# EAGLE design roboboard20M2 (EAGLE 7.1.0)
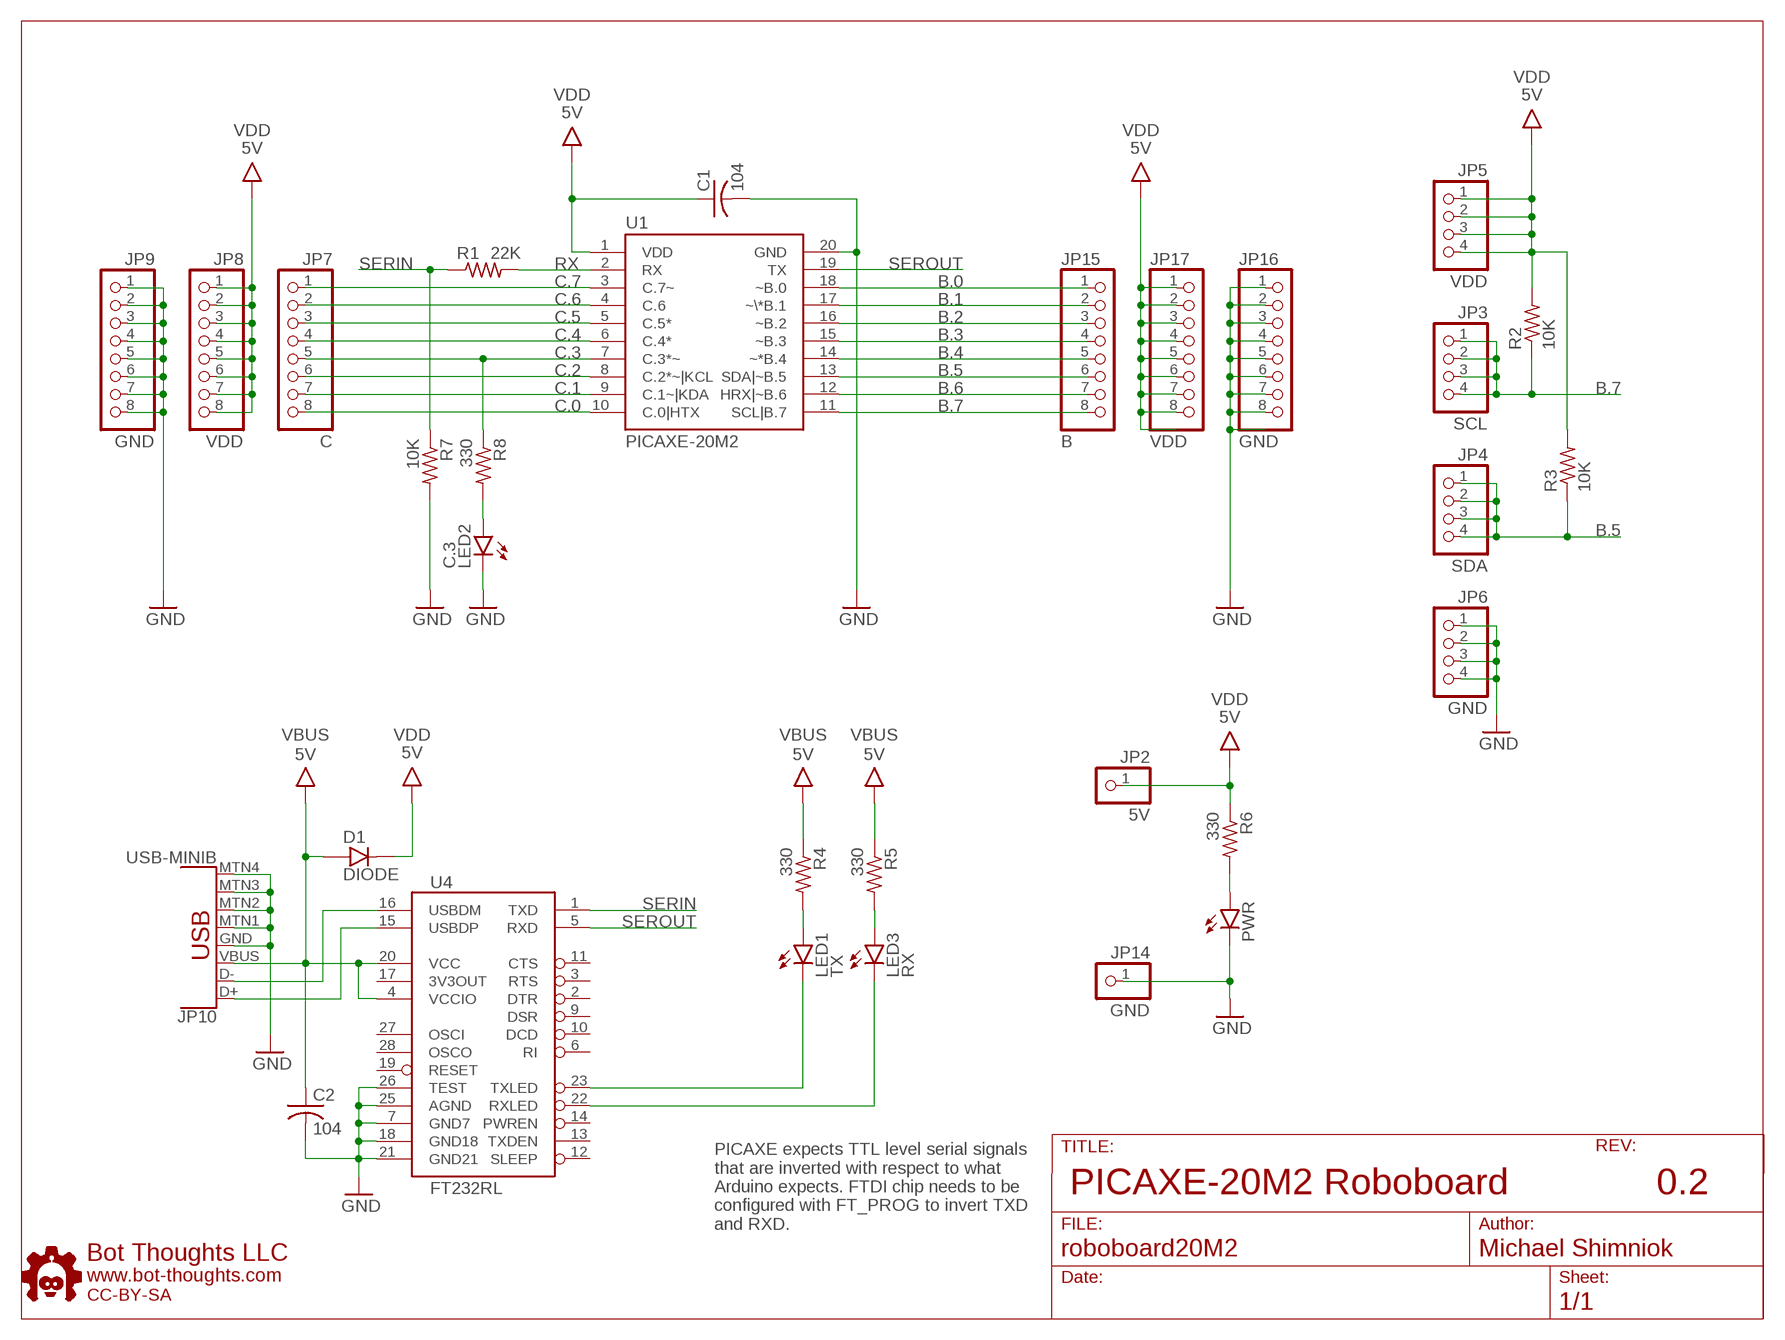
[diagram p0: schematic, sheet 1]

## Parts
C1  104  C-USC0603  [C0603]
C2  104  C-USC0603  [C0603]
D1  DIODE  DIODE_SOD123FL  [SOD123FL]
JP2  5V  PINHD-1X01_2.54-S  [1X01-S]
JP3  SCL  PINHD-1X04_2.54-S  [1X04-S]
JP4  SDA  PINHD-1X04_2.54-S  [1X04-S]
JP5  VDD  PINHD-1X04_2.54-S  [1X04-S]
JP6  GND  PINHD-1X04_2.54-S  [1X04-S]
JP7  C  PINHD-1X08_2.54-S  [1X08-S]
JP8  VDD  PINHD-1X08_2.54-S  [1X08-S]
JP9  GND  PINHD-1X08_2.54-S  [1X08-S]
JP10  USB-MINIB  [USB-MINIB]
JP14  GND  PINHD-1X01_2.54-S  [1X01-S]
JP15  B  PINHD-1X08_2.54-S  [1X08-S]
JP16  GND  PINHD-1X08_2.54-S  [1X08-S]
JP17  VDD  PINHD-1X08_2.54-S  [1X08-S]
LED1  TX  LEDCHIPLED_0805  [CHIPLED_0805]
LED2  C.3  LEDCHIPLED_1206  [CHIPLED_1206]
LED3  RX  LEDCHIPLED_0805  [CHIPLED_0805]
PWR  LEDCHIPLED_1206  [CHIPLED_1206]
R1  22K  R-US_R0603  [R0603]
R2  10K  R-US_R0603  [R0603]
R3  10K  R-US_R0603  [R0603]
R4  330  R-US_R0603  [R0603]
R5  330  R-US_R0603  [R0603]
R6  330  R-US_R0603  [R0603]
R7  10K  R-US_R0603  [R0603]
R8  330  R-US_R0603  [R0603]
U1  PICAXE-20M2  [DIL20]
U4  FT232RL  FT232RLSSOP  [SSOP28DB]
U$10  BTLOGO-LOGO-MD  [BTLOGOM]

## Nets
B.0: JP15.1 U1.18(~B.0)
B.1: JP15.2 U1.17(~\*B.1)
B.2: JP15.3 U1.16(~B.2)
B.3: JP15.4 U1.15(~B.3)
B.4: JP15.5 U1.14(~*B.4)
B.5: JP4.1 JP4.2 JP4.3 JP4.4 JP15.6 R3.1 U1.13(SDA|~B.5)
B.6: JP15.7 U1.12(HRX|~B.6)
B.7: JP3.1 JP3.2 JP3.3 JP3.4 JP15.8 R2.1 U1.11(SCL|B.7)
C.0: JP7.8 U1.10(C.0|HTX)
C.1: JP7.7 U1.9(C.1~|KDA)
C.2: JP7.6 U1.8(C.2*~|KCL)
C.3: JP7.5 R8.1 U1.7(C.3*~)
C.4: JP7.4 U1.6(C.4*)
C.5: JP7.3 U1.5(C.5*)
C.6: JP7.2 U1.4(C.6)
C.7: JP7.1 U1.3(C.7~)
GND: C1.2 C2.2 JP6.1 JP6.2 JP6.3 JP6.4 JP9.1 JP9.2 JP9.3 JP9.4 JP9.5 JP9.6 JP9.7 JP9.8 JP10.GND JP10.MTN1(SHIELD1) JP10.MTN2(SHIELD2) JP10.MTN3(SHIELD3) JP10.MTN4(SHIELD4) JP14.1 JP16.1 JP16.2 JP16.3 JP16.4 JP16.5 JP16.6 JP16.7 JP16.8 LED2.C PWR.C R7.2 U1.20(GND) U4.7(GND7) U4.18(GND18) U4.21(GND21) U4.25(AGND) U4.26(TEST)
N$1: LED2.A R8.2
N$2: PWR.A R6.2
N$3: LED1.C U4.23(TXLED)
N$5: LED1.A R4.2
N$7: LED3.A R5.2
N$8: JP10.D- U4.16(USBDM)
N$9: JP10.D+ U4.15(USBDP)
N$10: LED3.C U4.22(RXLED)
RX: R1.2 U1.2(RX)
SERIN: R1.1 R7.1 U4.1(TXD)
SEROUT: U1.19(TX) U4.5(RXD)
VBUS: C2.1 D1.A JP10.VBUS R4.1 R5.1 U4.4(VCCIO) U4.20(VCC) ; supply symbol labelled 5V
VDD: C1.1 D1.C JP2.1 JP5.1 JP5.2 JP5.3 JP5.4 JP8.1 JP8.2 JP8.3 JP8.4 JP8.5 JP8.6 JP8.7 JP8.8 JP17.1 JP17.2 JP17.3 JP17.4 JP17.5 JP17.6 JP17.7 JP17.8 R2.2 R3.2 R6.1 U1.1(VDD) ; supply symbol labelled 5V
Unconnected: U4.2(DTR) U4.3(RTS) U4.6(RI) U4.9(DSR) U4.10(DCD) U4.11(CTS) U4.12(SLEEP) U4.13(TXDEN) U4.14(PWREN) U4.17(3V3OUT) U4.19(RESET) U4.27(OSCI) U4.28(OSCO)

## Notes on the sheet
- PICAXE-20M2 Roboboard | 0.2
- PICAXE expects TTL level serial signals
  that are inverted with respect to what
  Arduino expects. FTDI chip needs to be
  configured with FT_PROG to invert TXD
  and RXD.

## Library data of the parts
C1 C2 = rcl:C-US: CAPACITOR, American symbol
D1 = bt_diode:DIODE: Diode Collection of generic diodes in various packages
JP2 JP14 = pinhead-2:PINHD-1X01: PIN HEADER
JP3-JP6 = pinhead-2:PINHD-1X04: PIN HEADER
JP7-JP9 JP15-JP17 = pinhead-2:PINHD-1X08: PIN HEADER
JP10 = bt_electromech:USB: USB Connectors USB-MINI-B is fully proven USB-A-PCB is untested. USB-MICRO-B is untested.; PROD_ID: CONN-08193
LED1-LED3 PWR = bt_opto:LED: LED Various packages
R1-R8 = resistor:R-US_: RESISTOR, American symbol
U1 = bt_pic:PICAXE-20M2: PICAXE 20 pin BASIC microcontroller chip PICAXE is a neat entry-level microcontroller system that is relatively cheap to get started with. The chip is programmed with a simple serial connection and the BASIC development environment is free! PICAXE has some excellent educational applications and support, and is a great entryway into more complicated embedded systems. If you’re look for a place to start with microcontrollers, PICAXE is a great way to go! datasheet.pdf <http://www.rev-ed.co.uk/docs/picaxe_manual1.pdf>
U4 = SparkFun-DigitalIC:FT232RL: USB UART FT232RL 4th Generation USB UART (USB <-> Serial) Controller. Spark Fun Electronics SKU : COM-00650 Production SKU IC-00870; PROD_ID: IC-00870
U$10 = bt:BTLOGO: Bot Thoughts Logo

## Board
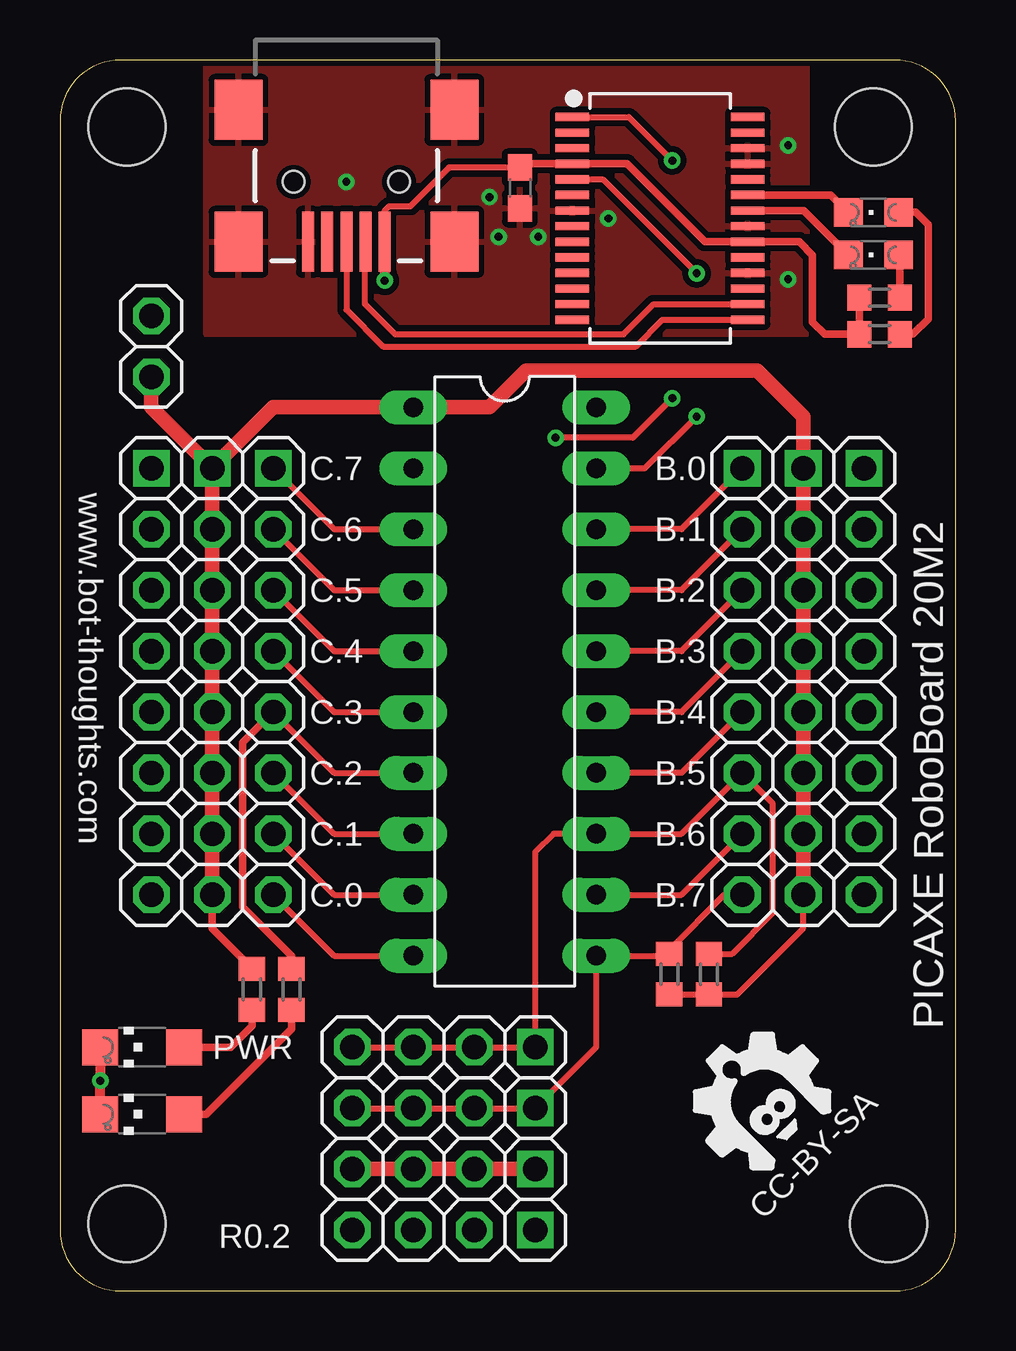
[diagram p1: board, top side]
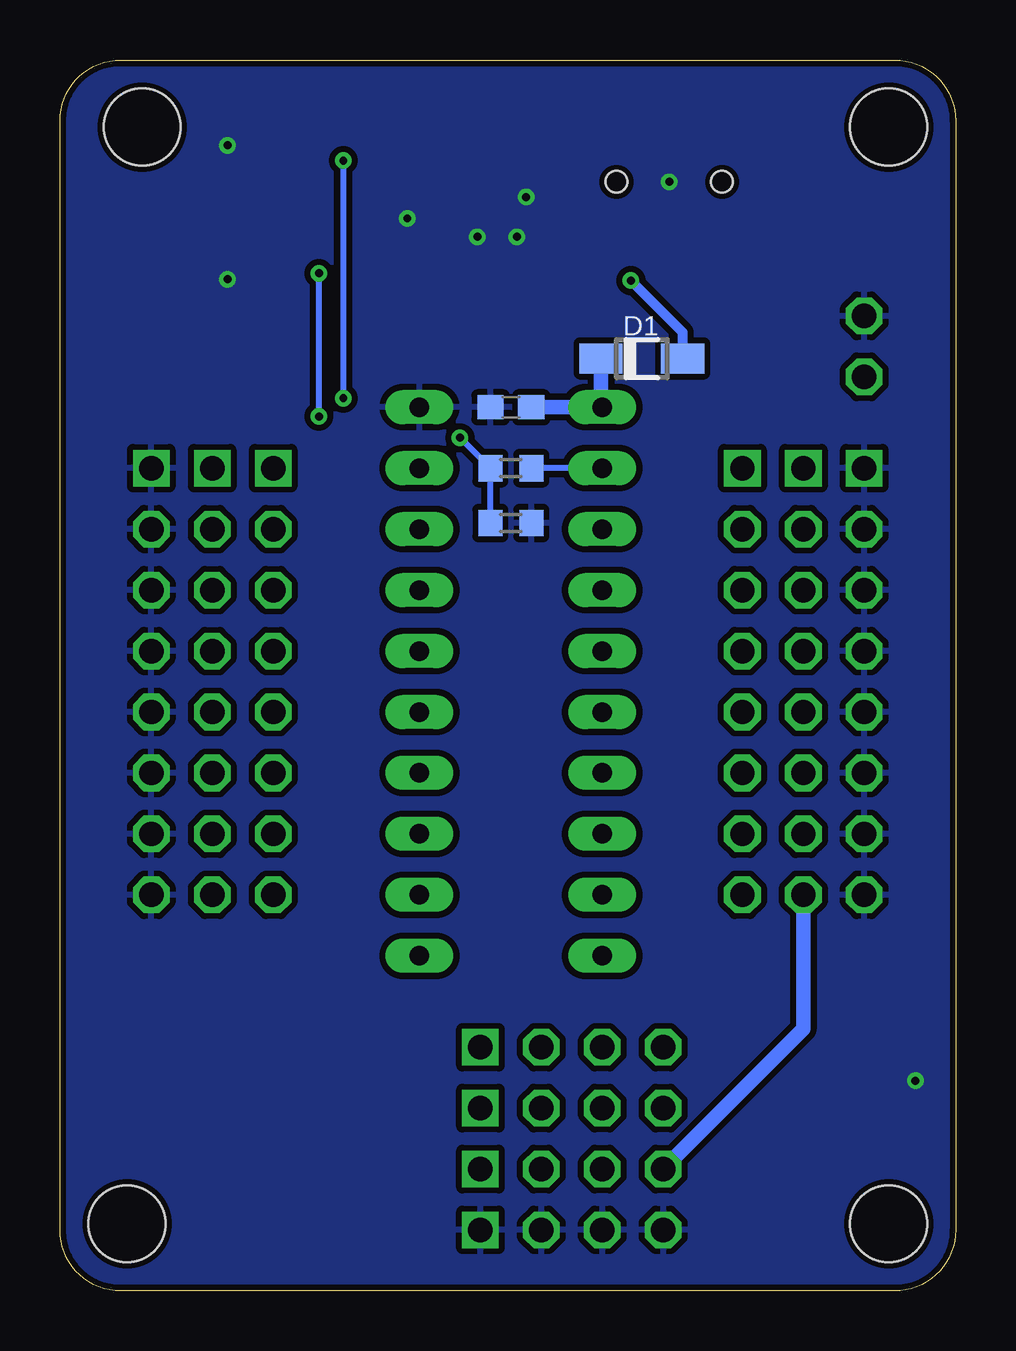
[diagram p2: board, bottom side, seen from below]

Size 37.34 x 51.31 mm. Coordinates in mm from the lower left corner, seen from the top.
Outline: 34.8,51.31 2.54,51.31 arc90 0,48.77 0,2.54 arc90 2.54,0 34.8,0 arc90 37.34,2.54 37.34,48.77 arc90 34.8,51.31
Copper layers (1*16): Top 0.0356mm / dielectric 1.5011mm / Bottom 0.0356mm
Design rules "LaenPCBOrder": minimum track width 6mil, minimum drill 13mil, track to track 10mil, track to pad 10mil, pad to pad 10mil, via to via 10mil, smd to smd 8mil, copper to edge 10mil, drill to drill 10mil, minimum pad ring 7mil, minimum via ring 7mil, stop-mask expansion 3mil, vias tented up to drill 20mil, thermal gap 10mil
Holes 3.2 mm at 2.79,48.51 33.91,48.51 34.54,2.79 2.79,2.79

### Footprints (pad centres in the part's own frame; a part is rotated, then mirrored left to right if it is on the bottom)
C0603 = smd 1.1 x 1: 1 -0.85,0; 2 0.85,0
SOD123FL = smd 1.8 x 1.25: A 1.7,0; C -1.7,0
1X01-S = drill 1.016 octagon: 1 0,0
1X04-S = drill 1.016 square: 1 -3.81,0 | drill 1.016 octagon: 2 -1.27,0; 3 1.27,0; 4 3.81,0
1X08-S = drill 1.016 square: 1 -8.89,0 | drill 1.016 octagon: 2 -6.35,0; 3 -3.81,0; 4 -1.27,0; 5 1.27,0; 6 3.81,0; 7 6.35,0; 8 8.89,0
USB-MINIB = smd 2.5 x 0.5: D+ 2.5,0; D- 2.5,0.8; GND 2.5,-1.6; ID 2.5,-0.8; VBUS 2.5,1.6 | smd 2.5 x 2: MTN1 -3,4.5; MTN2 2.5,4.5; MTN3 -3,-4.5; MTN4 2.5,-4.5 | hole 0.9: 0,2.2; 0,-2.2
CHIPLED_0805 = smd 1.2 x 1.2: A 0,-1.05; C 0,1.05
CHIPLED_1206 = smd 1.5 x 1.5: A 0,-1.75; C 0,1.75
R0603 = smd 1 x 1.1: 1 -0.85,0; 2 0.85,0
DIL20 = drill 0.813 pad 1.422 long: 1 -11.43,-3.81; 2 -8.89,-3.81; 3 -6.35,-3.81; 4 -3.81,-3.81; 5 -1.27,-3.81; 6 1.27,-3.81; 7 3.81,-3.81; 8 6.35,-3.81; 9 8.89,-3.81; 10 11.43,-3.81; 11 11.43,3.81; 12 8.89,3.81; 13 6.35,3.81; 14 3.81,3.81; 15 1.27,3.81; 16 -1.27,3.81; 17 -3.81,3.81; 18 -6.35,3.81; 19 -8.89,3.81; 20 -11.43,3.81
SSOP28DB = smd 0.348 x 1.397: 1 -4.225,-3.656; 2 -3.575,-3.656; 3 -2.925,-3.656; 4 -2.275,-3.656; 5 -1.625,-3.656; 6 -0.975,-3.656; 7 -0.325,-3.656; 8 0.325,-3.656; 9 0.975,-3.656; 10 1.625,-3.656; 11 2.275,-3.656; 12 2.925,-3.656; 13 3.575,-3.656; 14 4.225,-3.656; 15 4.225,3.656; 16 3.575,3.656; 17 2.925,3.656; 18 2.275,3.656; 19 1.625,3.656; 20 0.975,3.656; 21 0.325,3.656; 22 -0.325,3.656; 23 -0.975,3.656; 24 -1.625,3.656; 25 -2.275,3.656; 26 -2.925,3.656; 27 -3.575,3.656; 28 -4.225,3.656

### Placement (x,y rotation side)
C1  18.54,36.83 180 bottom
C2  19.18,45.97 270 top
D1  13.08,38.86 0 bottom
JP2  3.81,38.1 90 top
JP3  16,7.62 180 top
JP4  16,10.16 180 top
JP5  16,5.08 180 top
JP6  16,2.54 180 top
JP7  8.89,25.4 270 top
JP8  6.35,25.4 270 top
JP9  3.81,25.4 270 top
JP10  11.94,46.23 270 top
JP14  3.81,40.64 90 top
JP15  28.45,25.4 270 top
JP16  33.53,25.4 270 top
JP17  30.99,25.4 270 top
LED1  33.91,44.96 90 top
LED2  3.43,7.37 90 top
LED3  33.91,43.18 90 top
PWR  3.43,10.16 90 top
R1  18.54,34.29 0 bottom
R2  25.4,13.21 270 top
R3  27.05,13.21 270 top
R4  34.16,39.88 0 top
R5  34.16,41.4 0 top
R6  8,12.57 270 top
R7  18.54,32 0 bottom
R8  9.65,12.57 270 top
U1  18.54,25.4 270 top
U4  25.02,44.7 270 top
U$10  30.99,6.1 45 top

### Tracks (layer width: path | path; a pad name or v marks a point on that pad's centre or on a via)
B.0
  Top 0.254: JP15.1 25.91,31.75 U1.18
B.1
  Top 0.254: JP15.2 25.91,29.21 U1.17
B.2
  Top 0.254: JP15.3 25.91,26.67 U1.16
B.3
  Top 0.254: JP15.4 25.91,24.13 U1.15
B.4
  Top 0.254: JP15.5 25.91,21.59 U1.14
B.5
  Top 0.254: JP4.4 JP4.3 JP4.2 JP4.1 19.81,18.29 20.57,19.05 U1.13 25.91,19.05 JP15.6 29.72,20.32 29.72,15.75 28.03,14.06 R3.1
B.6
  Top 0.254: U1.12 25.91,16.51 JP15.7
B.7
  Top 0.254: JP3.4 JP3.3 JP3.2 JP3.1 22.35,10.16 U1.11 25.31,13.97 R2.1 25.4,14.22 27.69,16.51 JP15.8
C.0
  Top 0.254: JP7.8 11.43,13.97 U1.10
C.1
  Top 0.254: JP7.7 11.43,16.51 U1.9
C.2
  Top 0.254: JP7.6 11.43,19.05 U1.8
C.3
  Top 0.254: JP7.5 11.43,21.59 U1.7
  Top 0.305: R8.1 9.65,13.97 7.62,16 7.62,22.86 JP7.5
C.4
  Top 0.254: JP7.4 11.43,24.13 U1.6
C.5
  Top 0.254: JP7.3 11.43,26.67 U1.5
C.6
  Top 0.254: JP7.2 11.43,29.21 U1.4
C.7
  Top 0.254: JP7.1 11.43,31.75 U1.3
GND  (via drill 0.33)
  Top 0.406: LED2.C v1.68,8.76 PWR.C
  other vias: 11.94,46.23 19.94,43.94 30.35,47.75 30.35,42.16 17.91,45.59 18.29,43.94 22.86,44.7
  pour Bottom: 0,2.54 0,48.77 arc-90 2.54,51.31 34.8,51.31 arc-90 37.34,48.77 37.34,2.54 arc-90 34.8,0 2.54,0 arc-90
  pour Top: 6.1,51.05 31.11,51.05 31.11,39.88 6.1,39.88
N$1
  Top 0.305: R8.2 9.65,10.92 6.1,7.37 LED2.A
N$2
  Top 0.305: R6.2 8,11.05 7.11,10.16 PWR.A
N$3
  Top 0.305: U4.23 32.14,45.68 LED1.C
N$5
  Top 0.305: LED1.A 35.69,44.96 36.2,44.45 36.2,40.51 35.56,39.88 R4.2
N$7
  Top 0.305: R5.2 35.01,42.98 LED3.A
N$8
  Top 0.254: JP10.D- 12.7,43.69 12.7,41.15 13.97,39.88 23.5,39.88 24.75,41.13 U4.16
N$9
  Top 0.254: JP10.D+ 11.94,40.89 13.46,39.37 24,39.37 25.11,40.48 U4.15
N$10
  Top 0.305: U4.22 31.01,45.03 LED3.C
RX
  Bottom 0.254: U1.2 R1.2
SERIN  (via drill 0.33)
  Top 0.254: U4.1 23.71,48.93 v25.53,47.12 | v25.53,37.21 23.88,35.56 v20.66,35.56
  Bottom 0.254: R7.1 R1.1 v20.66,35.56 | v25.53,47.12 v25.53,37.21
SEROUT  (via drill 0.33)
  Top 0.254: U1.19 24.38,34.29 v26.54,36.45 | v26.54,42.42 22.63,46.33 U4.5
  Bottom 0.254: v26.54,36.45 v26.54,42.42
VBUS  (via drill 0.33)
  Top 0.254: C2.1 16.22,46.82 14.61,45.21 13.72,45.21 13.54,45.03 JP10.VBUS
  Top 0.305: R5.1 R4.1 31.88,39.88 31.37,40.39 31.37,43.18 30.82,43.73 U4.20 26.88,43.73 23.63,46.98 U4.4 19.33,46.98
  Top 0.406: 19.33,46.98 C2.1 | JP10.VBUS v13.54,42.11
  Bottom 0.406: v13.54,42.11 11.38,39.96 D1.A
VDD
  Top 0.254: R2.2 R3.2 28.23,12.36 30.99,15.11 JP17.8
  Top 0.305: JP8.8 6.35,15.11 7.87,13.59 7.83,13.59 R6.1
  Top 0.61: JP5.4 JP5.3 JP5.2 JP5.1 | JP8.8 JP8.7 JP8.6 JP8.5 JP8.4 JP8.3 JP8.2 JP8.1 | JP17.8 JP17.7 JP17.6 JP17.5 JP17.4 JP17.3 JP17.2 JP17.1 30.99,36.45 29.08,38.35 19.43,38.35 17.91,36.83 U1.1 8.89,36.83 JP8.1 | JP2.1 3.81,36.83 JP8.1
  Bottom 0.61: JP8.8 6.35,10.92 JP5.4 | C1.1 U1.1 14.78,37.16 D1.C

### Text on the board
tNames: C.7 | B.0 | www.bot-thoughts.com | C.6 | B.1 | C.5 | B.2 | C.4 | B.3 | C.3 | B.4 | C.2 | B.5 | C.1 | B.6 | C.0 | B.7 | PICAXE RoboBoard 20M2 | CC-BY-SA | R0.2